# Altium project TTNNode_V3.PrjPcb
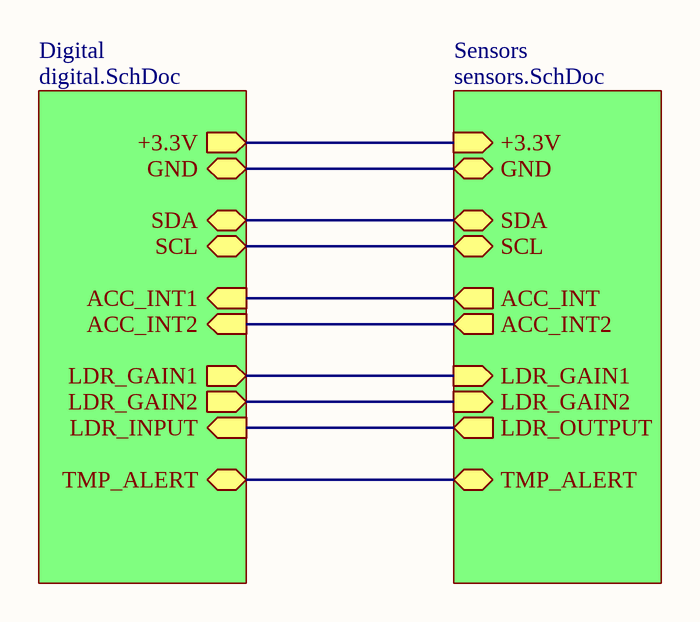
[diagram p0: toplevel.SchDoc]
TWTG_ProjectName: The Things Node
3 sheets, 63 parts. Net scope: hierarchical (ports join the sheet entries above them; power ports are global).
Board file: TTNNODE_V3.PcbDoc
Sheets:
  toplevel.SchDoc
    Digital = digital.SchDoc
    Sensors = sensors.SchDoc

## Sheet toplevel.SchDoc: The Things Node Toplevel
size A4; DocumentNumber: 1; SheetNumber: 1; SheetTotal: 3

### Sub-sheets
Digital = digital.SchDoc: +3.3V (out), GND (bidir), ACC_INT1 (in), SDA, SCL, LDR_GAIN1 (out), LDR_INPUT (in), LDR_GAIN2 (out), ACC_INT2 (in), TMP_ALERT
Sensors = sensors.SchDoc: +3.3V (in), GND (bidir), ACC_INT (out), SDA, SCL, LDR_GAIN1 (in), LDR_OUTPUT (out), LDR_GAIN2 (in), ACC_INT2 (out), TMP_ALERT

### Nets
GND: sheet Digital/GND, sheet Sensors/GND
+3.3V: sheet Digital/+3.3V, sheet Sensors/+3.3V
A6: sheet Digital/LDR_GAIN2, sheet Sensors/LDR_GAIN2
A8: sheet Digital/ACC_INT2, sheet Sensors/ACC_INT2
A9: sheet Digital/ACC_INT1, sheet Sensors/ACC_INT
A10: sheet Digital/LDR_INPUT, sheet Sensors/LDR_OUTPUT
A11: sheet Digital/LDR_GAIN1, sheet Sensors/LDR_GAIN1
D2: sheet Digital/SDA, sheet Sensors/SDA
D3#: sheet Digital/SCL, sheet Sensors/SCL
D14: sheet Digital/TMP_ALERT, sheet Sensors/TMP_ALERT

### Notes on the sheet
- Title
- Size:
- Date:
- A4
- Number:
- Time:
- Revision:
- Sheet
- of
- The Things Products
- Project:
- File:

## Sheet digital.SchDoc: Digital
size A3; DocumentNumber: 3; SheetNumber: 3; SheetTotal: 3
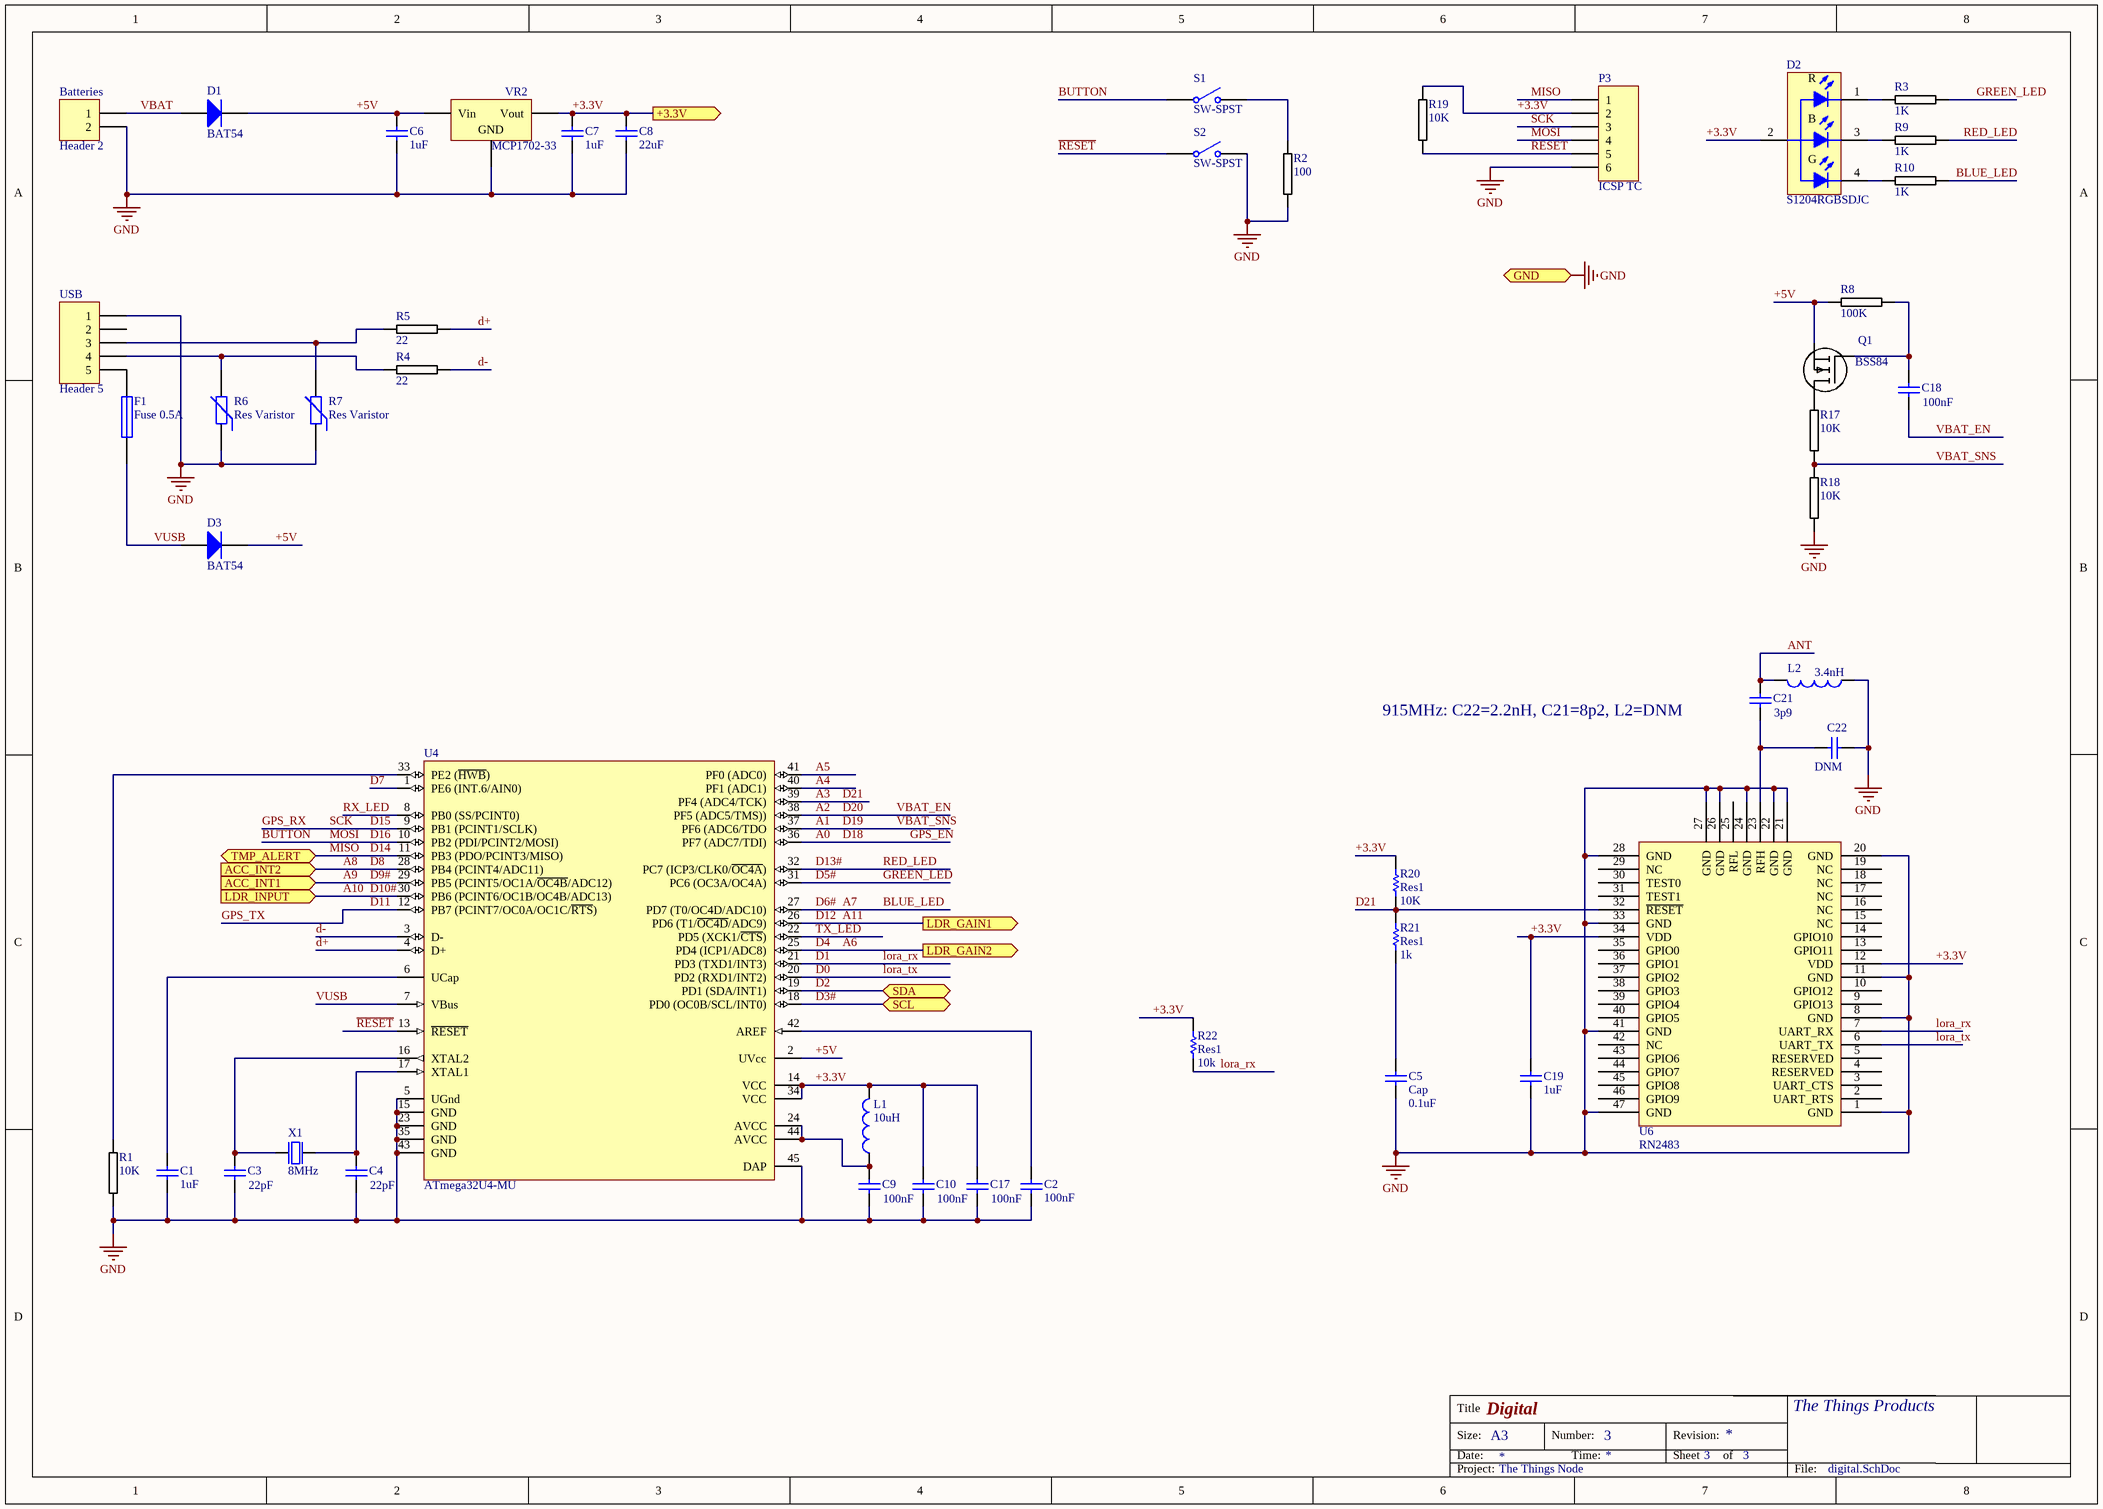
[diagram p1: digital.SchDoc]

### Parts
Batteries  Header 2  [3x AAA Holder]
C1  1uF  [C0805]
C2  100nF  [0402C-TBD]
C3  22pF  [0402C-TBD]
C4  22pF  [0402C-TBD]
C5  Cap  value 0.1uF  [0402C-TBD]
C6  1uF  [C0805]
C7  1uF  [C0805]
C8  22uF  [C1206]
C9  100nF  [0402C-TBD]
C10  100nF  [0402C-TBD]
C17  100nF  [0402C-TBD]
C18  100nF  [0402C-TBD]
C19  1uF  [C0805]
C21  3p9  [0402C-TBD]
C22  DNM  [0402C-TBD]
D1  BAT54  [SOD323]
D2  S1204RGBSDJC  [LED1204]
D3  BAT54  [SOD323]
F1  Fuse 0.5A  [1812]
L1  10uH  [J1-0603]
L2  3.4nH  [0402C-TBD]
P3  ICSP TC  [TC2030-MCP-NL]
Q1  BSS84  [SOT23-GDS]
R1  10K  [0402R-GENERIC]
R2  100  [0402R-GENERIC]
R3  1K  [0402R-GENERIC]
R4  22  [0402R-GENERIC]
R5  22  [0402R-GENERIC]
R6  Res Varistor  [6-0805_L]
R7  Res Varistor  [6-0805_L]
R8  100K  [0402R-GENERIC]
R9  1K  [0402R-GENERIC]
R10  1K  [0402R-GENERIC]
R17  10K  [0402R-GENERIC]
R18  10K  [0402R-GENERIC]
R19  10K  [0402R-GENERIC]
R20  Res1  value 10K  [0402R-GENERIC]
R21  Res1  value 1k  [0402R-GENERIC]
R22  Res1  value 10k  [0402R-GENERIC]
S1  SW-SPST  [SPST - 4x3 mm]
S2  SW-SPST  [SPST - 4x3 mm]
U4  ATmega32U4-MU  [44PW_M]
U6  RN2483  [RN2483 - duplicate]
USB  Header 5  [Vertical MicroUSB]
VR2  MCP1702-33  [SOT23_L]
X1  8MHz  [Crystal - ABM3B]

### Ports
+3.3V (out), ACC_INT1 (in), ACC_INT2 (in), GND (bidir), LDR_GAIN1 (out), LDR_GAIN2 (out), LDR_INPUT (in), SCL, SDA, TMP_ALERT

### Nets
GND: Batteries.2 C1.2 C2.2 C3.1 C4.1 C5.2 C6.1 C7.1 C8.1 C9.1 C10.1 C17.1 C19.1 C22.1 L2.1 P3.6 R1.1 R2.1 R6.1 R7.1 R18.2 S2.2(NO) U4.5(UGnd) U4.15(GND) U4.23(GND) U4.35(GND) U4.43(GND) U4.45(DAP) U6.1(GND) U6.8(GND) U6.11(GND) U6.20(GND) U6.21(GND) U6.22(GND) U6.24(GND) U6.26(GND) U6.27(GND) U6.28(GND) U6.33(GND) U6.41(GND) U6.47(GND) USB.1 VR2.2(GND) X1.2(GND) X1.4(GND) ; port GND
+3.3V: C7.2 C8.2 C10.2 C17.2 C19.2 D2.2(A2) L1.2 P3.2 R19.2 R20.1 R22.1 U4.14(VCC) U4.34(VCC) U6.12(VDD) U6.34(VDD) VR2.3(Vout) ; port +3.3V
+5V: C6.2 D1.2(K) D3.2(K) Q1.S R8.1 U4.2(UVcc) VR2.1(Vin)
~{RESET}: P3.5 R19.1 S2.1(COMMON) U4.13(~{RESET})
A0: U4.36(PF7_(ADC7/TDI))  [also labelled D18, GPS_EN]
A1: R17.2 R18.1 U4.37(PF6_(ADC6/TDO)  [also labelled D19, VBAT_SNS]
A2: C18.1 U4.38(PF5_(ADC5/TMS)))  [also labelled D20, VBAT_EN]
A3: R20.2 R21.2 U4.39(PF4_(ADC4/TCK)) U6.32(~{RESET})  [also labelled D21]
A4: U4.40(PF1_(ADC1))
A5: U4.41(PF0_(ADC0))
A6: U4.25(PD4_(ICP1/ADC8)) ; port LDR_GAIN2  [also labelled D4]
A7: R10.2 U4.27(PD7_(T0/OC4D/ADC10))  [also labelled BLUE_LED, D6#]
A8: U4.28(PB4_(PCINT4/ADC11)) ; port ACC_INT2  [also labelled D8]
A9: U4.29(PB5_(PCINT5/OC1A/~{OC4B}/ADC12)) ; port ACC_INT1  [also labelled D9#]
A10: U4.30(PB6_(PCINT6/OC1B/OC4B/ADC13)) ; port LDR_INPUT  [also labelled D10#]
A11: U4.26(PD6_(T1/~{OC4D}/ADC9)) ; port LDR_GAIN1  [also labelled D12]
ANT: C21.2 L2.2
BUTTON: P3.4 S1.1(COMMON) U4.10(PB2_(PDI/PCINT2/MOSI))  [also labelled D16, MOSI]
D0: U4.20(PD2_(RXD1/INT2)) U6.6(UART_TX)  [also labelled lora_tx]
D1: R22.2 U4.21(PD3_(TXD1/INT3)) U6.7(UART_RX)  [also labelled lora_rx]
D2: U4.19(PD1_(SDA/INT1)) ; port SDA
D3#: U4.18(PD0_(OC0B/SCL/INT0)) ; port SCL
D5#: R3.2 U4.31(PC6_(OC3A/OC4A))  [also labelled GREEN_LED]
D7: U4.1(PE6_(INT.6/AIN0))
D11: U4.12(PB7_(PCINT7/OC0A/OC1C/~{RTS}))  [also labelled GPS_TX]
D13#: R9.2 U4.32(PC7_(ICP3/CLK0/~{OC4A}))  [also labelled RED_LED]
D14: P3.1 U4.11(PB3_(PDO/PCINT3/MISO)) ; port TMP_ALERT  [also labelled MISO]
D15: P3.3 U4.9(PB1_(PCINT1/SCLK))  [also labelled GPS_RX, SCK]
d+: R5.1 U4.4(D+)
d-: R4.1 U4.3(D-)
RX_LED: U4.8(PB0_(SS/PCINT0))
TX_LED: U4.22(PD5_(XCK1/~{CTS}))
VBAT: Batteries.1 D1.1(A)
VUSB: D3.1(A) F1.1 U4.7(VBus)
NetC1_1: C1.1 U4.6(UCap)
NetC2_1: C2.1 U4.42(AREF)
NetC3_2: C3.2 U4.16(XTAL2) X1.1(inp)
NetC4_2: C4.2 U4.17(XTAL1) X1.3(out)
NetC5_1: C5.1 R21.1
NetC9_2: C9.2 L1.1 U4.24(AVCC) U4.44(AVCC)
NetC18_2: C18.2 Q1.G R8.2
NetC21_1: C21.1 C22.2 U6.23(RFH)
NetD2_1: D2.1(R) R3.1
NetD2_3: D2.3(B) R9.1
NetD2_4: D2.4(G) R10.1
NetF1_2: F1.2 USB.5
NetQ1_D: Q1.D R17.1
NetR1_2: R1.2 U4.33(PE2_(~{HWB}))
NetR2_2: R2.2 S1.2(NO)
NetR4_2: R4.2 R6.2 USB.4
NetR5_2: R5.2 R7.2 USB.3

Not connected (* = marked no-connect by the designer): U6 2(UART_RTS) 3(UART_CTS) 4(RESERVED) 5(RESERVED) 9(GPIO13) 10(GPIO12) 13(GPIO11) 14(GPIO10) 15(NC) 16(NC) 17(NC) 18(NC) 19(NC) 25(RFL) 29(NC) 30(TEST0) 31(TEST1) 35(GPIO0) 36(GPIO1) 37(GPIO2) 38(GPIO3) 39(GPIO4) 40(GPIO5) 42(NC) 43(GPIO6) 44(GPIO7) 45(GPIO8) 46(GPIO9); USB 2

### Notes on the sheet
- 915MHz: C22=2.2nH, C21=8p2, L2=DNM
- Title
- Size:
- Date:
- A3
- Number:
- Time:
- Revision:
- Sheet
- of
- The Things Products
- Project:
- File:

### Library data of the parts
Batteries = Header 2: Header, 2-Pin; LatestRevisionDate: 17-Jul-2002; LatestRevisionNote: Re-released for DXP Platform.; Publisher: Altium Limited
C1 C5-C8 C19 = Cap: Capacitor
  C5: Published: 8-Jun-2000; LatestRevisionDate: 17-Jul-2002; LatestRevisionNote: Re-released for DXP Platform.; PackageReference: RAD-0.3; Publisher: Altium Limited; PackageDescription: Radial Cap, Thru-Hole; 2 Leads; 0.3 in Pin Spacing
C2-C4 C9 C10 C17 C18 C21 C22 = Cap: Capacitor, X7R
  C21 C22: Supplier 1: Farnell; Supplier Part Number 1: 1835905
D1 D3 = Diode 1N5401: 3 Amp General Purpose Rectifier; pin to pad: 1>2 2>1
D2 = S1204RGBSDJC: Ultra-Bright RGB Tri-color LED Lamp, 4-Lead 1204-size SMD; pin to pad: 2>3 3>2; Published: 14-Mar-2008; DatasheetVersion: Aug-2006; PackageVersion: Aug-2006; PackageReference: LED1204; Publisher: Altium Limited; PackageDescription: SM Tri-color LED Lamp, 4-Leads 1204-size; ComponentLink1Description: Manufacturer Link; ComponentLink1URL: http://www.sansentech.com/; ComponentLink2Description: Datasheet; ComponentLink2URL: http://www.sansentech.com/LED/S1204RGBSDJC.pdf
F1 = Fuse 1: Fuse; Published: 8-Jun-2000; LatestRevisionDate: 17-Jul-2002; LatestRevisionNote: Re-released for DXP Platform.; PackageReference: PIN-W2/E2.8; Publisher: Altium Limited; PackageDescription: Thru-Hole; 2 Leads
L1 L2 = Inductor
P3 = Header 6: Header, 6-Pin; LatestRevisionDate: 17-Jul-2002; LatestRevisionNote: Re-released for DXP Platform.; Publisher: Altium Limited
Q1 = 2N7002-SOT23: P Channel BSS84; Manufacturer: Fairchild Semiconductor; Manufacturer Part Number: 2N7002; Drain to Source Voltage (Vdss): 60V; Vgs(th) (Max) @ Id: 2.5V @ 250µA; Power - Max: 200mW; Current - Continuous Drain (Id) @ 25° C: 115mA; Rds On (Max) @ Id, Vgs: 7.5 Ohm @ 500mA, 10V; FET Type: MOSFET N-Channel, Metal Oxide; FET Feature: Logic Level Gate; Input Capacitance (Ciss) @ Vds: 50pF @ 25V; Reel: Q2; Supplier 1: Digi-Key; Supplier Part Number 1: 2N7002NTR-ND; Package / Case: SOT-23-3, TO-236-3, Micro3™, SSD3, SST3; RoHS: RoHS Compliant; Mounting Type: Surface Mount; Packaging: Tape & Reel (TR); Gate Charge (Qg) @ Vgs: -; Supplier Part Number: 2N7002NTR-ND; Supplier: Digi-Key; Category: Discrete Semiconductor Products
R1-R5 R8-R10 R17-R19 = 0402R-GENERIC: RESISTOR 0402 GENERIC
R6 R7 = Res Varistor: Varistor (Voltage-Sensitive Resistor); Published: 24-Mar-1999; LatestRevisionDate: 29-May-2009; LatestRevisionNote: IPC-7351 Footprint Added.; PackageVersion: Mar-2003; PackageReference: 6-0805; Publisher: Altium Limited; PackageDescription: Chip Resistor 0805 Case Size; Code_IPC: RESC2012
R20-R22 = Res1: Resistor; Published: 8-Jun-2000; LatestRevisionDate: 17-Jul-2002; LatestRevisionNote: Re-released for DXP Platform.; PackageReference: AXIAL-0.3; Publisher: Altium Limited; PackageDescription: Axial Device, Thru-Hole; 2 Leads; 0.3 in Pin Spacing
S1 S2 = SW-SPST: Single-Pole, Single-Throw Switch; Published: 24-Mar-1999; LatestRevisionDate: 17-Jul-2002; LatestRevisionNote: Re-released for DXP Platform.; PackageReference: SPST-2; Publisher: Altium Limited; PackageDescription: Switch; 2 Leads
U4 = ATmega32U4-MU: 8-bit AVR Microcontroller, 2.7-5.5V, 32KB Flash, 2.5KB EEPROM, 1KB SRAM, USB Controller, 44-pin QFN, Industrial Grade (-40°C to 85°C); Published: 1-Apr-2010; DatasheetVersion: revD, Jan-2009; PackageVersion: revF, Jul-2007; PackageReference: 44PW; Publisher: Altium Limited; PackageDescription: 44-Pin Quad Flat No-Lead Package, 7 x 7 mm Body, 0.5 mm Pitch (QFN); Supplier 1: Digi-Key; Supplier Part Number 1: ATMEGA32U4-MU-ND; Supplier 2: Mouser; Supplier Part Number 2: 556-ATMEGA32U4-MU; Code_JEDEC: MO-220-VKKD-1; ComponentLink1Description: Manufacturer Link; ComponentLink1URL: http://www.atmel.com/products/avr/default.asp?; ComponentLink2Description: ATmega16U4/32U4 Datasheet; ComponentLink2URL: http://www.atmel.com/dyn/resources/prod_documents/doc7766.pdf; ComponentLink3Description: ATmega16U4 ATmega32U4 Summary; ComponentLink3URL: http://www.atmel.com/dyn/resources/prod_documents/7766S.pdf; ComponentLink4Description: Atmel.com Home; ComponentLink4URL: http://www.atmel.com
USB = Header 5: Header, 5-Pin; LatestRevisionDate: 17-Jul-2002; LatestRevisionNote: Re-released for DXP Platform.; Publisher: Altium Limited
VR2 = Volt Reg: Voltage Regulator; pin to pad: 2>3 3>2; Published: 24-Mar-1999; LatestRevisionDate: 29-May-2009; LatestRevisionNote: IPC-7351 Footprint Added.; PackageReference: D2PAK; Publisher: Altium Limited; PackageDescription: 3-Pin Transistor Outline Package 2.54 mm Pitch, 15.1 mm Lead Span
X1 = NX2520SA-16MHZ-STD-CSW-5: XTAL SMD 5032, 8MHz; Manufacturer: NDK; Note: XTAL SMD 16.000MHz; Artikkelnr Noca: 22019192; Artikkelnr Simpro: N.A.; Part Number: NX2520SA-16MHZ-STD-CSW-5; Manufacturer Part Number: NX2520SA-16MHZ-STD-CSW-5; Datasheet: http://www.ndk.com/images/products/catalog/c_NX2520SA-STD-CSW-5_e.pdf; LatestRevisionDate: 2012-06-15; Pin Count: 4; Publisher: Nordic Semiconductor; Published: 2012-06-15; Value: 8MHz; Supplier: Digi-Key; Supplier part number: 644-1169-1-ND; 2nd source Supplier: *; 2nd source part number: *; Footprint Doc: BT-XTAL_2520

## Sheet sensors.SchDoc: Sensors
size A4; DocumentNumber: 2; SheetNumber: 2; SheetTotal: 3
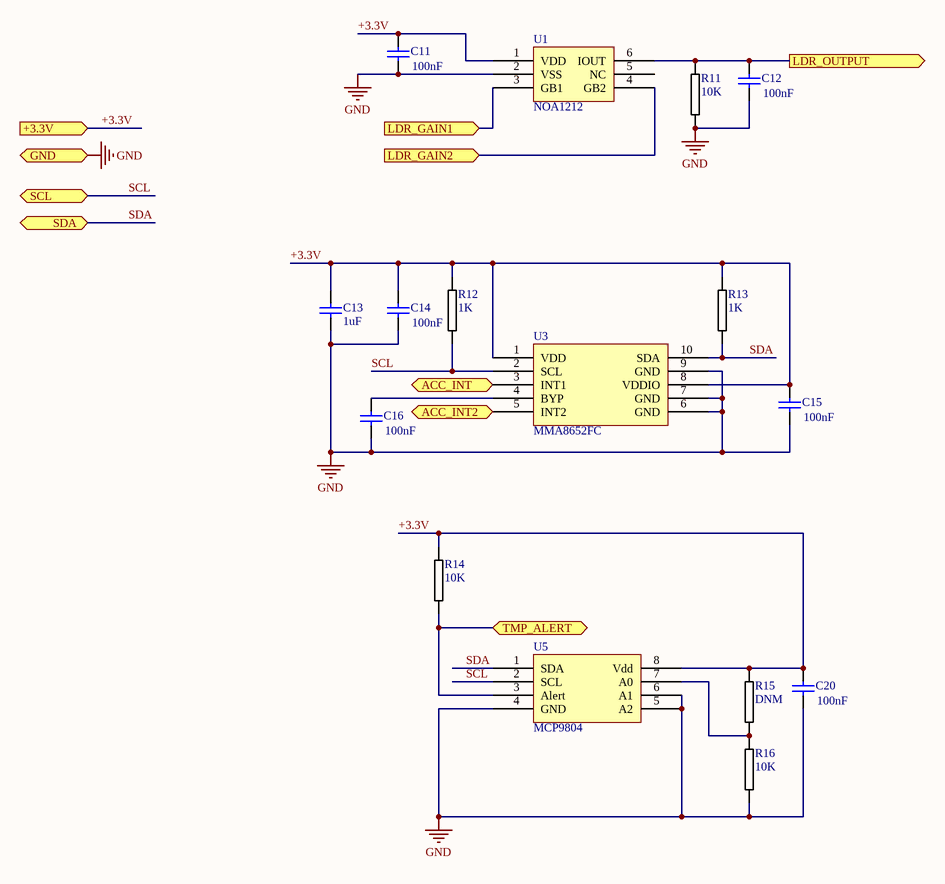
[diagram p2: sensors.SchDoc]

### Parts
C11  100nF  [0402C-TBD]
C12  100nF  [0402C-TBD]
C13  1uF  [C0805]
C14  100nF  [0402C-TBD]
C15  100nF  [0402C-TBD]
C16  100nF  [0402C-TBD]
C20  100nF  [0402C-TBD]
R11  10K  [0402R-GENERIC]
R12  1K  [0402R-GENERIC]
R13  1K  [0402R-GENERIC]
R14  10K  [0402R-GENERIC]
R15  DNM  [0402R-GENERIC]
R16  10K  [0402R-GENERIC]
U1  NOA1212  [NOA1212]
U3  MMA8652FC  [DFN10]
U5  MCP9804  [MSOP-MS8_N]

### Ports
+3.3V (in), ACC_INT2 (out), ACC_INT (out), GND (bidir), LDR_GAIN1 (in), LDR_GAIN2 (in), LDR_OUTPUT (out), SCL, SDA, TMP_ALERT

### Nets
GND: C11.1 C12.1 C13.1 C14.1 C15.1 C16.1 C20.1 R11.1 R16.1 U1.2(VSS) U3.6(GND) U3.7(GND) U3.9(GND) U5.4(GND) U5.5(A2) U5.6(A1) ; port GND
+3.3V: C11.2 C13.2 C14.2 C15.2 C20.2 R12.2 R13.2 R14.2 R15.2 U1.1(VDD) U3.1(VDD) U3.8(VDDIO) U5.8(Vdd) ; port +3.3V
A6: U1.4(GB2) ; port LDR_GAIN2
A8: U3.5(INT2) ; port ACC_INT2
A9: U3.3(INT1) ; port ACC_INT
A10: C12.2 R11.2 U1.6(IOUT) ; port LDR_OUTPUT
A11: U1.3(GB1) ; port LDR_GAIN1
D14: R14.1 U5.3(Alert) ; port TMP_ALERT
SCL: R12.1 U3.2(SCL) U5.2(SCL) ; port SCL  [project net D3#]
SDA: R13.1 U3.10(SDA) U5.1(SDA) ; port SDA  [project net D2]
NetC16_2: C16.2 U3.4(BYP)
NetR15_1: R15.1 R16.2 U5.7(A0)

Not connected (* = marked no-connect by the designer): U1 5(NC)

### Notes on the sheet
- Title
- Size:
- Date:
- A4
- Number:
- Time:
- Revision:
- Sheet
- of
- The Things Products
- Project:
- File:

### Library data of the parts
C11 C12 C14-C16 C20 = Cap: Capacitor, X7R
C13 = Cap: Capacitor
R11-R16 = 0402R-GENERIC: RESISTOR 0402 GENERIC

## Nets that join several sheets
GND: digital (45 pins), sensors (16 pins)
+3.3V: digital (16 pins), sensors (13 pins)
A6: digital (U4.25), sensors (U1.4)
A8: digital (U4.28), sensors (U3.5)
A9: digital (U4.29), sensors (U3.3)
A10: digital (U4.30), sensors (C12.2 R11.2 U1.6)
A11: digital (U4.26), sensors (U1.3)
D2: digital (U4.19), sensors (R13.1 U3.10 U5.1)
D3#: digital (U4.18), sensors (R12.1 U3.2 U5.2)
D14: digital (P3.1 U4.11), sensors (R14.1 U5.3)